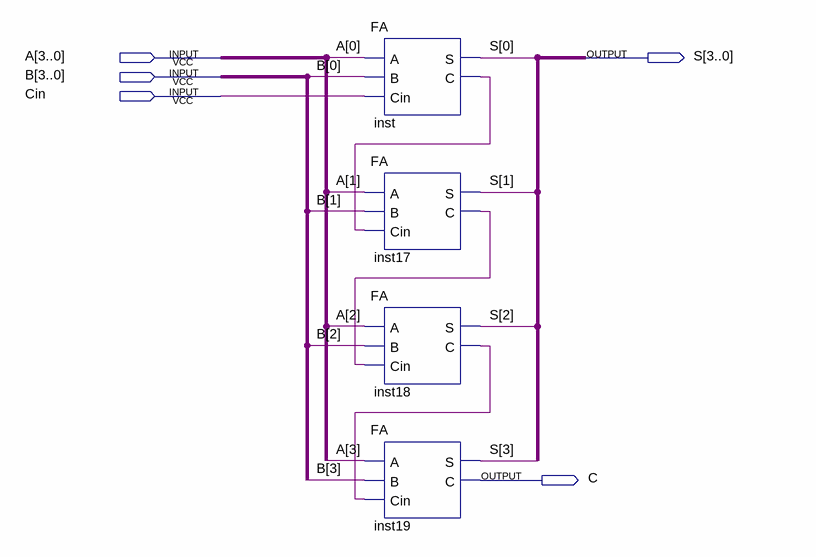
[diagram p0: schematic sheet]
// Quartus schematic Adder4.bdf as structural Verilog: 4 symbols, 5 pins
module Adder4 (
  input  [3:0] A,
  input  [3:0] B,
  input  Cin,
  output [3:0] S,
  output C
);

  wire inst17_c, inst18_c, inst_c;

  FA inst (.A(A[0]), .B(B[0]), .Cin(Cin), .S(S[0]), .C(inst_c));
  FA inst17 (.A(A[1]), .B(B[1]), .Cin(inst_c), .S(S[1]), .C(inst17_c));
  FA inst18 (.A(A[2]), .B(B[2]), .Cin(inst17_c), .S(S[2]), .C(inst18_c));
  FA inst19 (.A(A[3]), .B(B[3]), .Cin(inst18_c), .S(S[3]), .C(C));
endmodule
